# Altium schematic sheet MCU Schematic.SchDoc
size B; SheetNumber: 2; SheetTotal: 2
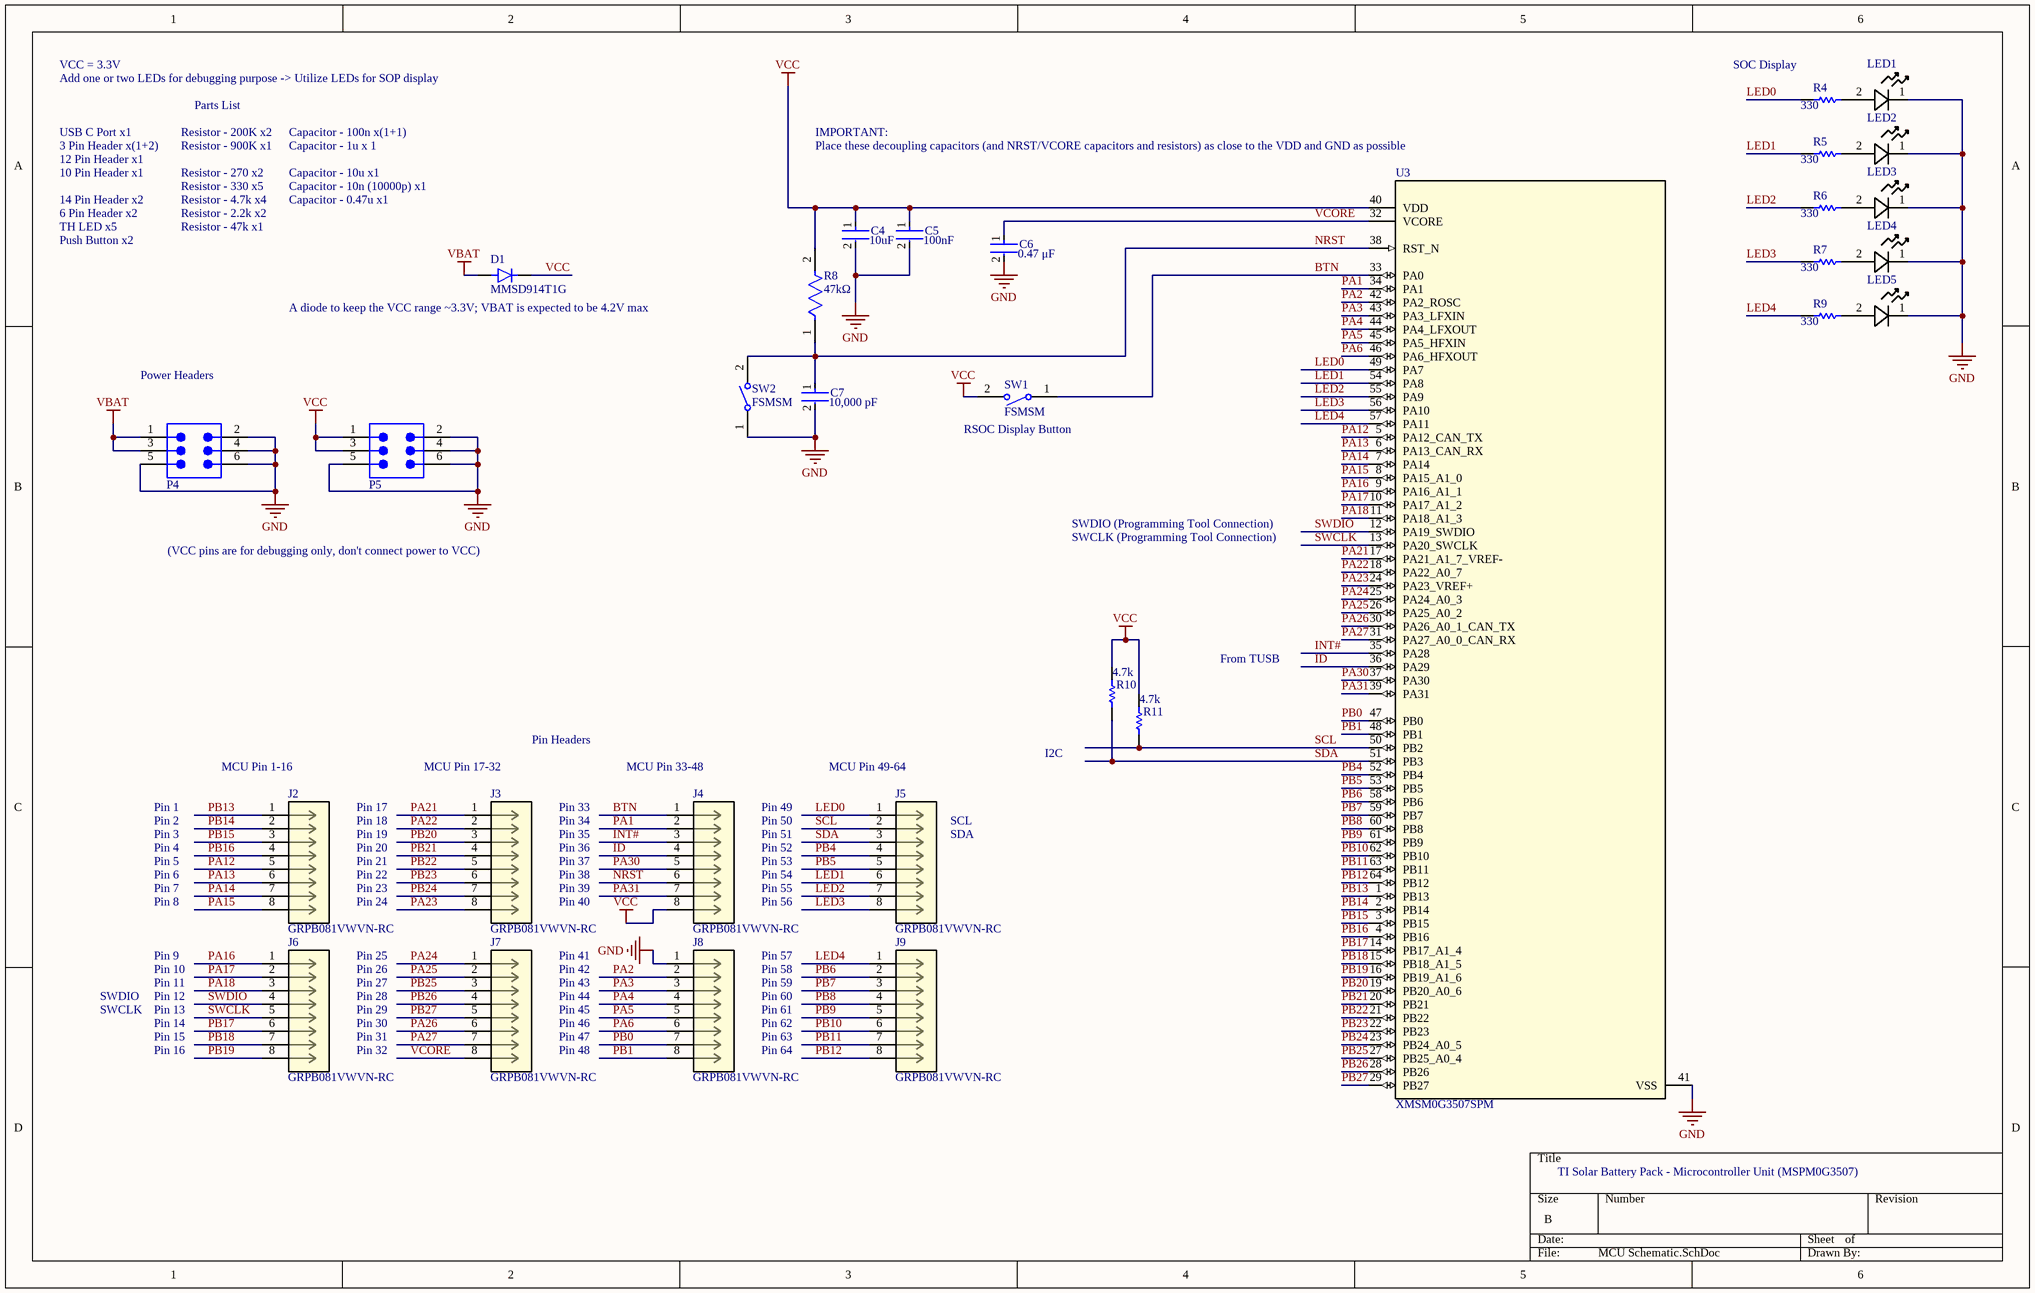
[diagram p0: MCU Schematic.SchDoc]

## Parts
C4  Capacitance: 10uF  [FP-C0805C106J8RACAUTO-MFG]  (hidden comment: C0805C106J8RACAUTO)
C5  Capacitance: 100nF  [FP-GRMJN6-0_1-MFG]  (hidden comment: GRMJN65C1H104GE01J)
C6  value 0.47 μF  [FP-C0603C-CF-MFG]  (hidden comment: C0603C474J4RACTU)
C7  value 10,000 pF  [FP-C0603C-CF-MFG]  (hidden comment: C0603C103J5RACTU)
D1  MMSD914T1G  [DIO_MMSD914T1G]
J2  GRPB081VWVN-RC  [CONN8_VWVN-RC_SUL]
J3  GRPB081VWVN-RC  [CONN8_VWVN-RC_SUL]
J4  GRPB081VWVN-RC  [CONN8_VWVN-RC_SUL]
J5  GRPB081VWVN-RC  [CONN8_VWVN-RC_SUL]
J6  GRPB081VWVN-RC  [CONN8_VWVN-RC_SUL]
J7  GRPB081VWVN-RC  [CONN8_VWVN-RC_SUL]
J8  GRPB081VWVN-RC  [CONN8_VWVN-RC_SUL]
J9  GRPB081VWVN-RC  [CONN8_VWVN-RC_SUL]
LED1  LTW-420D7  [LED_LTW-420D7_LTO]  (value not drawn)
LED2  LTW-420D7  [LED_LTW-420D7_LTO]  (value not drawn)
LED3  LTW-420D7  [LED_LTW-420D7_LTO]  (value not drawn)
LED4  LTW-420D7  [LED_LTW-420D7_LTO]  (value not drawn)
LED5  LTW-420D7  [LED_LTW-420D7_LTO]  (value not drawn)
P4  61000621121  [61000621121]  (value not drawn)
P5  61000621121  [61000621121]  (value not drawn)
R4  value 330  [RESC2013X60X40LL20T25]  (hidden comment: ERA6AEB331V)
R5  value 330  [RESC2013X60X40LL20T25]  (hidden comment: ERA6AEB331V)
R6  value 330  [RESC2013X60X40LL20T25]  (hidden comment: ERA6AEB331V)
R7  value 330  [RESC2013X60X40LL20T25]  (hidden comment: ERA6AEB331V)
R8  Resistance: 47kΩ  [FP-ERA6A-MFG]  (hidden comment: ERA-6AEB473V)
R9  value 330  [RESC2013X60X40LL20T25]  (hidden comment: ERA6AEB331V)
R10  value 4.7k  [RESC2013X60X40ML20T25]  (hidden comment: ERA6AEB472V)
R11  value 4.7k  [RESC2013X60X40ML20T25]  (hidden comment: ERA6AEB472V)
SW1  FSMSM  [TECO-FSMSM-2_V]
SW2  FSMSM  [TECO-FSMSM-2_V]
U3  XMSM0G3507SPM  [PM0064A-IPC_A]

## Nets
GND: C4.2 C5.2 C6.2 C7.2 J8.1 LED1.1 LED2.1 LED3.1 LED4.1 LED5.1 P4.2 P4.4 P4.5 P4.6 P5.2 P5.4 P5.5 P5.6 SW2.1 U3.41(VSS)
VBAT: D1.A P4.1 P4.3
VCC: C4.1 C5.1 D1.K J4.8 P5.1 P5.3 R8.2 R10.2 R11.2 SW1.2 U3.40(VDD)
BTN: J4.1 SW1.1 U3.33(PA0)
ID: J4.4 U3.36(PA29)
INT#: J4.3 U3.35(PA28)
LED0: J5.1 R4.1 U3.49(PA7)
LED1: J5.6 R5.1 U3.54(PA8)
LED2: J5.7 R6.1 U3.55(PA9)
LED3: J5.8 R7.1 U3.56(PA10)
LED4: J9.1 R9.1 U3.57(PA11)
NRST: C7.1 J4.6 R8.1 SW2.2 U3.38(RST_N)
PA1: J4.2 U3.34(PA1)
PA2: J8.2 U3.42(PA2_ROSC)
PA3: J8.3 U3.43(PA3_LFXIN)
PA4: J8.4 U3.44(PA4_LFXOUT)
PA5: J8.5 U3.45(PA5_HFXIN)
PA6: J8.6 U3.46(PA6_HFXOUT)
PA12: J2.5 U3.5(PA12_CAN_TX)
PA13: J2.6 U3.6(PA13_CAN_RX)
PA14: J2.7 U3.7(PA14)
PA15: J2.8 U3.8(PA15_A1_0)
PA16: J6.1 U3.9(PA16_A1_1)
PA17: J6.2 U3.10(PA17_A1_2)
PA18: J6.3 U3.11(PA18_A1_3)
PA21: J3.1 U3.17(PA21_A1_7_VREF-)
PA22: J3.2 U3.18(PA22_A0_7)
PA23: J3.8 U3.24(PA23_VREF+)
PA24: J7.1 U3.25(PA24_A0_3)
PA25: J7.2 U3.26(PA25_A0_2)
PA26: J7.6 U3.30(PA26_A0_1_CAN_TX)
PA27: J7.7 U3.31(PA27_A0_0_CAN_RX)
PA30: J4.5 U3.37(PA30)
PA31: J4.7 U3.39(PA31)
PB0: J8.7 U3.47(PB0)
PB1: J8.8 U3.48(PB1)
PB4: J5.4 U3.52(PB4)
PB5: J5.5 U3.53(PB5)
PB6: J9.2 U3.58(PB6)
PB7: J9.3 U3.59(PB7)
PB8: J9.4 U3.60(PB8)
PB9: J9.5 U3.61(PB9)
PB10: J9.6 U3.62(PB10)
PB11: J9.7 U3.63(PB11)
PB12: J9.8 U3.64(PB12)
PB13: J2.1 U3.1(PB13)
PB14: J2.2 U3.2(PB14)
PB15: J2.3 U3.3(PB15)
PB16: J2.4 U3.4(PB16)
PB17: J6.6 U3.14(PB17_A1_4)
PB18: J6.7 U3.15(PB18_A1_5)
PB19: J6.8 U3.16(PB19_A1_6)
PB20: J3.3 U3.19(PB20_A0_6)
PB21: J3.4 U3.20(PB21)
PB22: J3.5 U3.21(PB22)
PB23: J3.6 U3.22(PB23)
PB24: J3.7 U3.23(PB24_A0_5)
PB25: J7.3 U3.27(PB25_A0_4)
PB26: J7.4 U3.28(PB26)
PB27: J7.5 U3.29(PB27)
SCL: J5.2 R11.1 U3.50(PB2)
SDA: J5.3 R10.1 U3.51(PB3)
SWCLK: J6.5 U3.13(PA20_SWCLK)
SWDIO: J6.4 U3.12(PA19_SWDIO)
VCORE: C6.1 J7.8 U3.32(VCORE)
NetLED1_2: LED1.2 R4.2
NetLED2_2: LED2.2 R5.2
NetLED3_2: LED3.2 R6.2
NetLED4_2: LED4.2 R7.2
NetLED5_2: LED5.2 R9.2

## Notes on the sheet
- Add one or two LEDs for debugging purpose -> Utilize LEDs for SOP display
- VCC = 3.3V
- (near R4) SOC Display
- USB C Port x1
- 3 Pin Header x(1+2)
- 12 Pin Header x1
- Resistor - 200K x2
- Resistor - 900K x1
- Parts List
- Capacitor - 100n x(1+1)
- Capacitor - 1u x 1
- Place these decoupling capacitors (and NRST/VCORE capacitors and resistors) as close to the VDD and GND as possible
- IMPORTANT:
- 10 Pin Header x1
- 14 Pin Header x2
- 6 Pin Header x2
- TH LED x5
- Resistor - 270 x2
- Resistor - 330 x5
- Resistor - 4.7k x4
- Resistor - 2.2k x2
- Resistor - 47k x1
- Capacitor - 10u x1
- Capacitor - 10n (10000p) x1
- Capacitor - 0.47u x1
- Push Button x2
- (near D1) A diode to keep the VCC range ~3.3V; VBAT is expected to be 4.2V max
- Power Headers
- (near SW1) RSOC Display Button
- (VCC pins are for debugging only, don't connect power to VCC)
- SWCLK (Programming Tool Connection)
- SWDIO (Programming Tool Connection)
- From TUSB
- (near J2) MCU Pin 1-16
- (near J3) MCU Pin 17-32
- Pin Headers
- (near J4) MCU Pin 33-48
- (near J5) MCU Pin 49-64
- I2C
- Pin 1
- Pin 2
- Pin 3
- Pin 17
- Pin 18
- Pin 19
- Pin 33
- Pin 34
- Pin 35
- Pin 49
- Pin 50
- Pin 51
- SCL
- SDA
- Pin 4
- Pin 5
- Pin 6
- Pin 7
- Pin 8
- Pin 20
- Pin 21
- Pin 22
- Pin 23
- Pin 24
- Pin 36
- Pin 37
- Pin 38
- Pin 39
- Pin 40
- Pin 52
- Pin 53
- Pin 54
- Pin 55
- Pin 56
- Pin 9
- Pin 10
- Pin 25
- Pin 26
- Pin 41
- Pin 42
- Pin 57
- Pin 58
- SWDIO
- SWCLK
- Pin 11
- Pin 12
- Pin 13
- Pin 14
- Pin 15
- Pin 27
- Pin 28
- Pin 29
- Pin 30
- Pin 31
- Pin 43
- Pin 44
- Pin 45
- Pin 46
- Pin 47
- Pin 59
- Pin 60
- Pin 61
- Pin 62
- Pin 63
- Pin 16
- Pin 32
- Pin 48
- Pin 64
- TI Solar Battery Pack - Microcontroller Unit (MSPM0G3507)

## Library data of the parts
C4 = CMP-03020-034708-1: CAP CER 10UF 10V X7R 0805; Tolerance: 5%; Mount: Surface Mount; Voltage Rating: 10V; Max Operating Temperature: 125°C; Min Operating Temperature: -55°C; Case/Package: 0805; RoHS Compliant: Yes; Packaging: Tape and Reel; Case Code (Imperial): 0805; Case Code (Metric): 2012; Ratings: AEC-Q200
C5 = CMP-00260-135708738-1: GRMJN65C1H104GE01J Multilayer Ceramic Capacitor, 0.1 uF, 50 V, ± 2%, C0G (NP0), 0704 [1810 Metric]; Voltage Rating: 50V; Temperature Coefficient: 30ppm/°C; Material: Ceramic; Tolerance: 2%; Case/Package: 0704; NexarPartId: 135708738; Height: 650µm; Lifecycle Status: Production; Min Operating Temperature: -55°C; Max Operating Temperature: 125°C
C6 = CMP-1035-02699-3: CAP CER 0.47UF 16V X7R 0603; Manufacturer: KEMET; Tolerance: 0.05; Temperature Coefficient: 30ppm/°C; Material: Ceramic; Automotive Grade: Grade 1; Manufacturer Part Number: C0603C474J4RACTU; Lead Free: Yes; Temperature Range Low: -55°C; Height: 0.87mm; Automotive: Yes; Device Class L2: Capacitors; Temperature Characteristic: X7R; Capacitance: 0.47 μF; Octopart: https://octopart.com/c0603c474j4ractu-kemet-15711632; Temperature Range High: +125°C; Temperature: -55°C to +125°C; Voltage Rating: 16 V; Device Class L1: Passive Components; ComponentLink2URL: https://api.kemet.com/component-edge/download/datasheet/C0603C100J5GACAUTO.pdf; Device Class L3: Ceramic Capacitors; Digikey Description: CAP CER 0.47UF 16V X7R 0603; Category: Cap; ComponentLink2Description: Datasheet; RoHS: TRUE; Mouser Description: Multilayer Ceramic Capacitors MLCC - SMD/SMT .47UF 16V 5% 0603; Package: C0603C-CF
C7 = CMP-2006-03817-3: Capacitor; Ceramic; Cap; .010uF; Tol 5%; SMT; Vol-Rtg 50V; X7R; Tape and Reel; Manufacturer: KEMET; Automotive Grade: Grade 1; Temperature Coefficient: 30ppm/°C; Tolerance: 0.05; Device Class L1: Passive Components; Temperature Range High: +125°C; Lead Free: Yes; Digikey Description: Capacitor; Ceramic; Cap; .010uF; Tol 5%; SMT; Vol-Rtg 50V; X7R; Tape and Reel; Temperature Range Low: -55°C; Voltage Rating: 50 V; Device Class L2: Capacitors; Octopart: https://octopart.com/c0603c103j5ractu-kemet-91371; ComponentLink2URL: https://api.kemet.com/component-edge/download/datasheet/C0603C100J5GACAUTO.pdf; Temperature Characteristic: X7R; Height: 0.87mm; ComponentLink2Description: Datasheet; Category: Cap; Manufacturer Part Number: C0603C103J5RACTU; Temperature: -55°C to +125°C; Device Class L3: Ceramic Capacitors; Mouser Description: Capacitor; Ceramic; Cap; .010uF; Tol 5%; SMT; Vol-Rtg 50V; X7R; Tape and Reel; RoHS: TRUE; Package: C0603C-CF; Automotive: Yes; Material: Ceramic; Capacitance: 10,000 pF
D1 = MMSD914T1G: Diode Standard 100 V 200mA (DC) Surface Mount SOD-123; MF: ON Semiconductor; SnapEDA_Link: https://www.snapeda.com/parts/MMSD914T1G/Onsemi/view-part/?ref=snap; Package: SOD-123-2 ON Semiconductor; Value: *; MP: MMSD914T1G; Check_prices: https://www.snapeda.com/parts/MMSD914T1G/Onsemi/view-part/?ref=eda
J2-J9 = GRPB081VWVN-RC: No Description Available; Mfr_Name: Sullins; RefDes: RefDes; Type: Type
LED1-LED5 = LTW-420D7: No Description Available; Mfr_Name: LITE-ON
P4 P5 = 61000621121: WR-PHD Pin Header, SMT, Vertical, pitch 2.54mm, 2 Row, 6P; Manufacturer: Wurth Elektronik; Contact Resistance: 20mOhm; Rated Current: 3A; Working Voltage: 250V; Withstanding Voltage: 500V; Manufacturer Part Number: 61000621121; Category: Board-to-Board Connectors; Match Code: WR-PHD; ComponentLink1Description: Website Link; ComponentLink1URL: https://www.we-online.com/redexpert/article/61000621121?ad; ComponentLink2Description: Datasheet Link; ComponentLink2URL: https://www.we-online.com/redexpert/spec/61000621121?ad; Mount: Surface Mount; Operating Temperature Max: 125°C; Operating Temperature Min: -40°C; Packaging: Tube; Gender: Pin Header; Number of Pins: 6; Number of Rows: 2; Orientation: Vertical; Pitch: 2.54mm
R4-R7 R9 = CMP-2001-00628-1: Manufacturer: Panasonic; Part Number: ERA6AEB331V
R8 = CMP-2001-00645-2: NexarPartId: 1264112; Voltage Rating (DC): 100V; Max Power Dissipation: 125mW; Temperature Coefficient: 25ppm/°C; Tolerance: 0.1%; Case Code (Metric): 2012; Packaging: Cut Tape; Number of Terminations: 2; Max Operating Temperature: 155°C; Height: 500µm; Number of Pins: 2; Min Operating Temperature: -55°C; RoHS: Compliant; Features: Automotive AEC-Q200; Schedule B: 8533210045, 8533210045; Contact Plating: Tin; Case Code (Imperial): 0805; Lead Free: Lead Free; Lifecycle Status: Production; Termination: SMD/SMT; Weight: 5.499807mg; REACH SVHC: No SVHC; Voltage Rating: 100V; Mount: Surface Mount; Radiation Hardening: No; Military Standard: Not; Power Rating: 125mW; Length: 2mm; Depth: 1.25mm; Width: 1.25mm; Composition: Metal Film, Thin Film; Case/Package: 0805
R10 R11 = CMP-2001-00644-1: Manufacturer: Panasonic; Manufacturer Part Number: ERA-6AEB472V; Voltage Rating: 100V; Power Rating: 125mW; Tolerance: 0.1%; Temperature Coefficient: 25ppm/°C; Part Number: ERA6AEB472V; Supplier: Mouser; Supplier Part Number: 667-ERA-6AEB472V; RoHS: Yes; Category: Chip SMD Resistors; Stock: 30218; Pricing: 1=0.13, 10=0.075, 50=0.075, 100=0.068, 1000=0.047, 10000=0.034 (USD); Mounting Technology: Surface Mount; Case/Package: 0805; Pins: 2; Case Code (Metric): 2012; Case Code (Imperial): 0805; Contact Plating: Tin; Min Operating Temperature: -55°C; Max Operating Temperature: 155°C; Packaging: Tape and Reel; Package Quantity: 1; Resistor Type: Thin Film; Number of Terminations: 2; Termination: SMD/SMT; Max Power Dissipation: 125mW; Voltage Rating (DC): 100V; Features: Automotive AEC-Q200; Series: ERA-6A; Resistance Tolerance: 0.1%; Construction: Rectangular; Technology: METAL FILM; Length: 2mm; Width: 1.25mm; Height: 0.5mm; Depth: 1.25mm; Ratings: AEC-Q200; Reach SVHC Compliant: No; Military Standard: Not; Lead Free: Lead Free; RoHS Compliant: Yes; ComponentLink1URL: https://datasheet.ciiva.com/11811/0900766b80beefcc-11811885.pdf?src-supplier=Rs; ComponentLink1Description: https://datasheet.ciiva.com/11811/0900766b80beefcc-11811885.pdf?src-supplier=Rs; ComponentLink2URL: https://datasheet.ciiva.com/9195/aoa0000ce26-9195772.pdf?src-supplier=Avnet; ComponentLink2Description: https://datasheet.ciiva.com/9195/aoa0000ce26-9195772.pdf?src-supplier=Avnet; ComponentLink3URL: https://datasheet.ciiva.com/7830/485442-7830655.pdf?src-supplier=Element14; ComponentLink3Description: https://datasheet.ciiva.com/7830/485442-7830655.pdf?src-supplier=Element14; ComponentLink4URL: https://datasheet.ciiva.com/22743/485442-22743070.pdf?src-supplier=Element14; ComponentLink4Description: https://datasheet.ciiva.com/22743/485442-22743070.pdf?src-supplier=Element14; ComponentLink5URL: https://datasheet.ciiva.com/48425/era-eng-tds-48425609.pdf?src-supplier=Distrelec; ComponentLink5Description: https://datasheet.ciiva.com/48425/era-eng-tds-48425609.pdf?src-supplier=Distrelec; ComponentLink6URL: https://datasheet.ciiva.com/48536/era-eng-tds-48536668.pdf?src-supplier=Distrelec; ComponentLink6Description: https://datasheet.ciiva.com/48536/era-eng-tds-48536668.pdf?src-supplier=Distrelec; ComponentLink7URL: https://datasheet.ciiva.com/16395/aoa0000ce26-16395272.pdf?src-supplier=Future+Electronics; ComponentLink7Description: https://datasheet.ciiva.com/16395/aoa0000ce26-16395272.pdf?src-supplier=Future+Electronics
SW1 SW2 = CMP-2000-07511-1: FSMSM Push Button Switch, 50 mA, -35 to 85 degC, 2-Pin SMD, RoHS, Bulk; Manufacturer: TE Connectivity; Actuator Length: 1.07mm; Electrical Life: 20000Cycles; Actuator Material: Polyamide; Current Rating: 50mA; Illumination Type: Illuminated; Voltage Rating (DC): 24V; Contact Resistance: 100mOhm; Case\/Package: SMD/SMT; Operating Force: 180gf; Switch Travel: 0.25mm; Max Voltage Rating (DC): 12V; Throw Configuration: SPST; Packaging: LoosePiece; Max Operating Temperature: 85degC; ELV: Compliant; Package Description: 2-Pin Surface Mount Device, Body 6 x 3.5 mm, Pitch 9.19 mm; RoHSCompliant: true; Manufacturer URL: http://www.te.com/; Contact Plating: Silver; Contact Material: Brass; Mounting Technology: SurfaceMount; Contact Current Rating: 50mA; Datasheet Version: Rev. C2, 08/2014; Datasheet URL: http://www.te.com/commerce/DocumentDelivery/DDEController?Action=showdoc&DocId=Customer+Drawing%7F1437566-3%7FC2%7Fpdf%7FEnglish%7FENG_CD_1437566-3_C2_1437566_3_1_c.dwg.pdf%7F1437566-3; Mechanical Life: 20000Cycles; Package Reference: FSMSM; REACH SVHC: Unknown; Orientation: Straight; Min Operating Temperature: -35degC; Lead Free: LeadFree; Termination: GullWing; Package Quantity: 1000; Mount: SurfaceMount
U3 = XMSM0G3507SPM: No Description Available; Mfr_Name: Texas Instruments; TYPE: TYPE; RefDes: RefDes